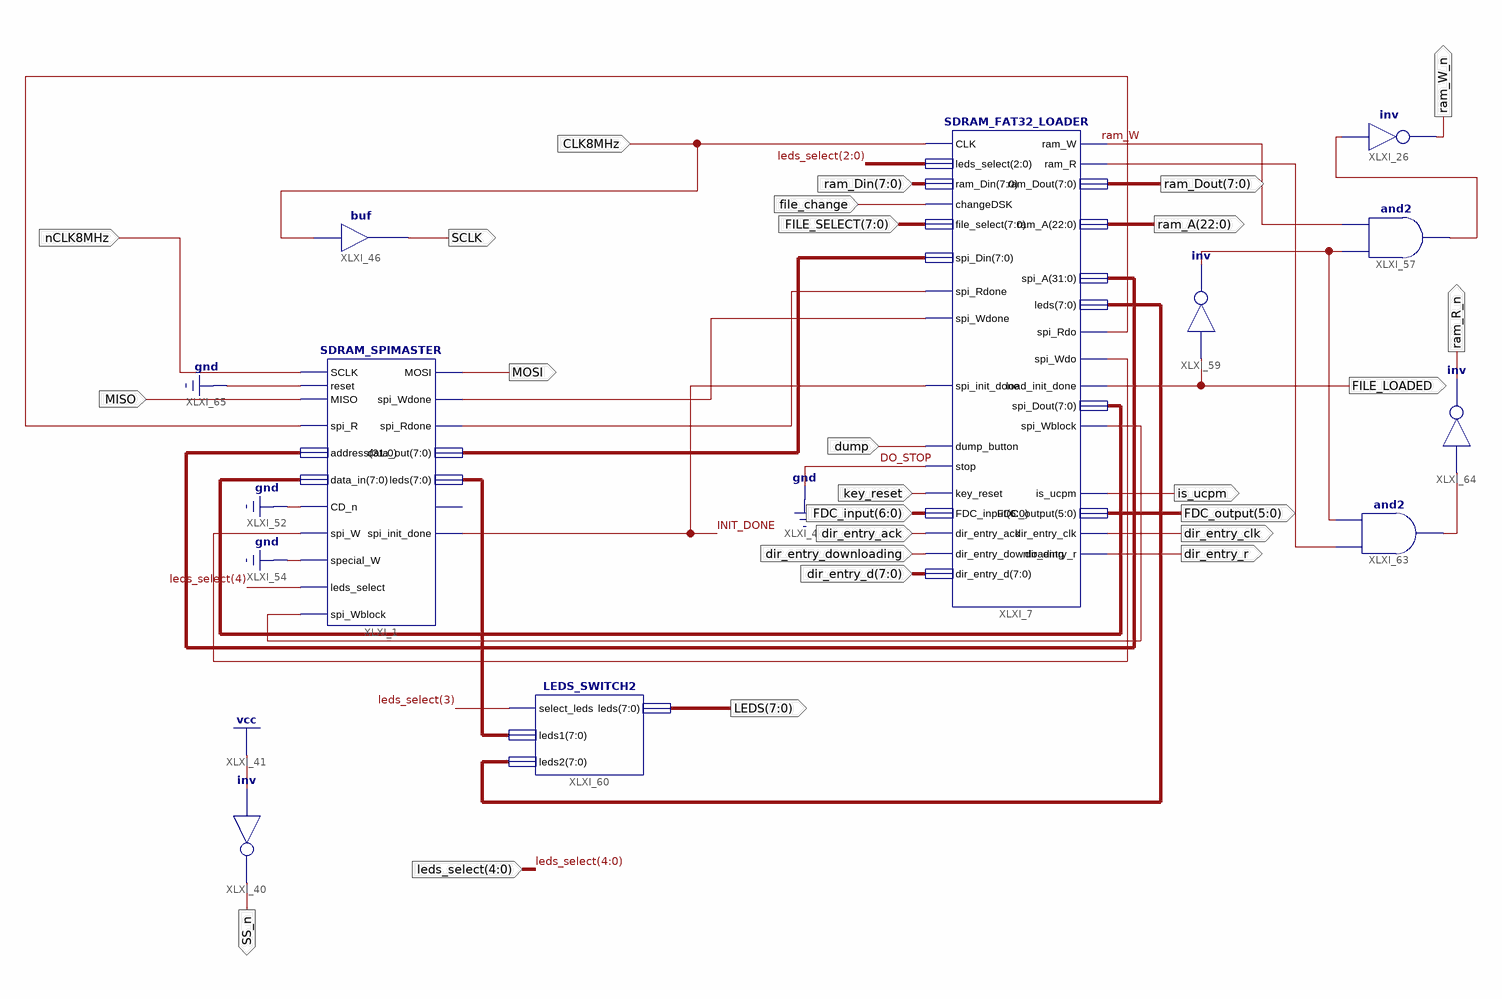
[diagram p0: schematic sheet 1]
// Xilinx ISE schematic bootloader_sd.sch (artix7) as structural Verilog: 10 symbols, 26 ports
module bootloader_sd (
  input  MISO,
  input  [7:0] FILE_SELECT,
  input  CLK8MHz,
  input  nCLK8MHz,
  input  dump,
  input  [4:0] leds_select,
  input  key_reset,
  input  file_change,
  input  [6:0] FDC_input,
  input  [7:0] ram_Din,
  input  dir_entry_ack,
  input  dir_entry_downloading,
  input  [7:0] dir_entry_d,
  output MOSI,
  output [22:0] ram_A,
  output SCLK,
  output is_ucpm,
  output FILE_LOADED,
  output ram_W_n,
  output [7:0] LEDS,
  output SS_n,
  output [5:0] FDC_output,
  output [7:0] ram_Dout,
  output ram_R_n,
  output dir_entry_clk,
  output dir_entry_r
);

  wire INIT_DONE, ram_W, XLXN_94, XLXN_98, XLXN_99, XLXN_100, XLXN_101, XLXN_126, XLXN_127, XLXN_128,
       XLXN_129;
  wire [7:0] XLXN_52, XLXN_103, XLXN_107, XLXN_114;
  wire [31:0] XLXN_55;

  SDRAM_SPIMASTER XLXI_1 (
    .reset(1'b0), .SCLK(nCLK8MHz), .MISO(MISO), .CD_n(1'b0), .spi_R(XLXN_100), .spi_W(XLXN_101),
    .spi_Wblock(XLXN_129), .special_W(1'b0), .leds_select(leds_select[4]), .address(XLXN_55),
    .data_in(XLXN_103), .MOSI(MOSI), .spi_Rdone(XLXN_98), .spi_Wdone(XLXN_99), .spi_init_done(INIT_DONE),
    .data_out(XLXN_52), .leds(XLXN_107));  // open: SS_n
  SDRAM_FAT32_LOADER XLXI_7 (
    .CLK(CLK8MHz), .spi_Rdone(XLXN_98), .spi_Wdone(XLXN_99), .spi_init_done(INIT_DONE), .dump_button(dump),
    .stop(1'b0), .key_reset(key_reset), .changeDSK(file_change), .dir_entry_ack(dir_entry_ack),
    .dir_entry_downloading(dir_entry_downloading), .file_select(FILE_SELECT), .ram_Din(ram_Din),
    .spi_Din(XLXN_52), .leds_select(leds_select[2:0]), .FDC_input(FDC_input), .ram_W(ram_W),
    .ram_R(XLXN_126), .spi_Rdo(XLXN_100), .spi_Wdo(XLXN_101), .spi_Wblock(XLXN_129),
    .load_init_done(FILE_LOADED), .is_ucpm(is_ucpm), .dir_entry_clk(dir_entry_clk),
    .dir_entry_r(dir_entry_r), .ram_A(ram_A), .ram_Dout(ram_Dout), .spi_A(XLXN_55), .spi_Dout(XLXN_103),
    .leds(XLXN_114), .FDC_output(FDC_output), .dir_entry_d(dir_entry_d));
  buf XLXI_46 (SCLK, CLK8MHz);
  and XLXI_57 (XLXN_94, XLXN_127, ram_W);
  not XLXI_26 (ram_W_n, XLXN_94);
  not XLXI_59 (XLXN_127, FILE_LOADED);
  LEDS_SWITCH2 XLXI_60 (.select_leds(leds_select[3]), .leds1(XLXN_107), .leds2(XLXN_114), .leds(LEDS));
  not XLXI_40 (SS_n, 1'b1);
  and XLXI_63 (XLXN_128, XLXN_126, XLXN_127);
  not XLXI_64 (ram_R_n, XLXN_128);
endmodule
